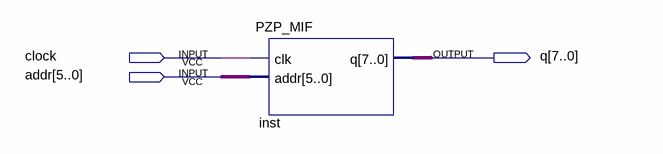
[diagram p0: schematic sheet]
// Quartus schematic Block1.bdf as structural Verilog: 1 symbols, 3 pins
module Block1 (
  input  clock,
  input  [5:0] addr,
  output [7:0] q
);

  PZP_MIF inst (.clk(clock), .addr(addr), .q(q));
endmodule
